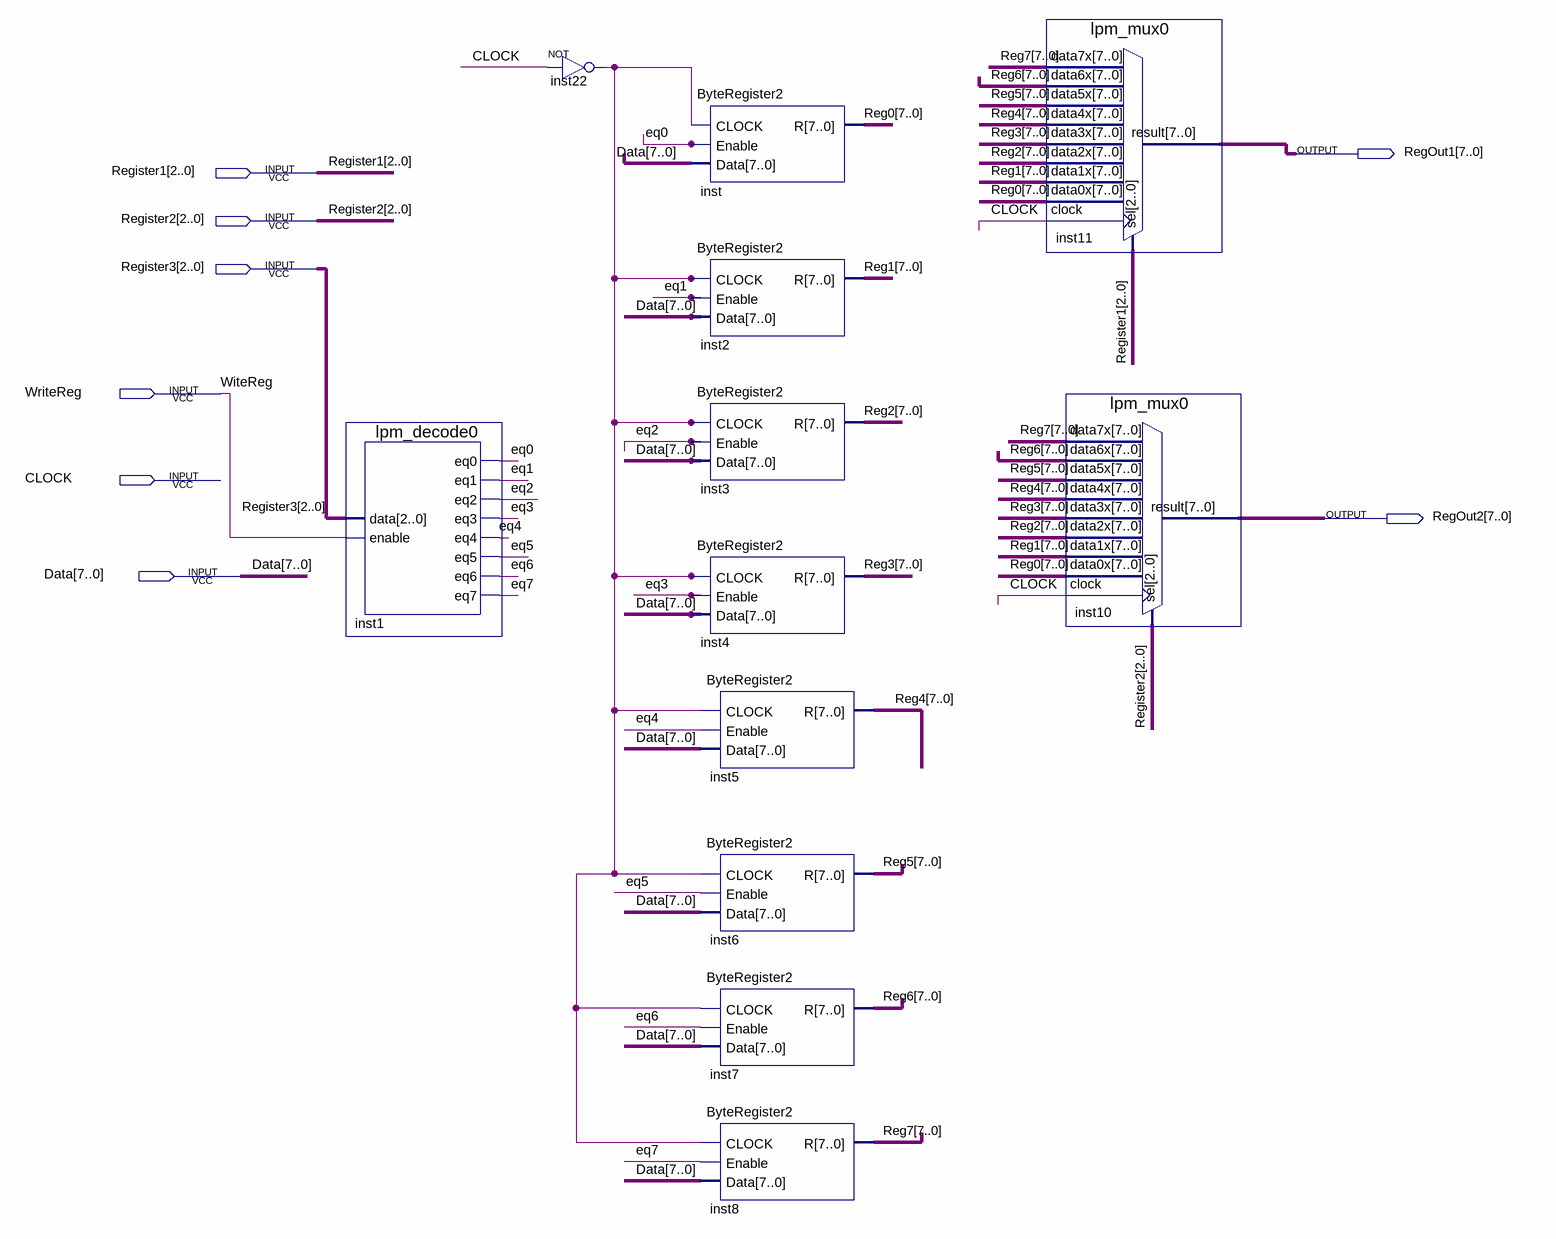
[diagram p0: schematic sheet]
// Quartus schematic registerFile2.bdf as structural Verilog: 12 symbols, 8 pins
module registerFile2 (
  input  [2:0] Register1,
  input  [2:0] Register2,
  input  [2:0] Register3,
  input  WriteReg,
  input  CLOCK,
  input  [7:0] Data,
  output [7:0] RegOut1,
  output [7:0] RegOut2
);

  wire eq0, eq1, eq2, eq3, eq4, eq5, eq6, eq7, inst22_out;
  wire [7:0] Reg0, Reg1, Reg2, Reg3, Reg4, Reg5, Reg6, Reg7;

  lpm_decode0 inst1 (
    .data(Register3), .enable(WriteReg), .eq0(eq0), .eq1(eq1), .eq2(eq2), .eq3(eq3), .eq4(eq4), .eq5(eq5),
    .eq6(eq6), .eq7(eq7));
  not inst22 (inst22_out, CLOCK);
  ByteRegister2 inst (.CLOCK(inst22_out), .Enable(eq0), .Data(Data), .R(Reg0));
  ByteRegister2 inst2 (.CLOCK(inst22_out), .Enable(eq1), .Data(Data), .R(Reg1));
  ByteRegister2 inst3 (.CLOCK(inst22_out), .Enable(eq2), .Data(Data), .R(Reg2));
  ByteRegister2 inst4 (.CLOCK(inst22_out), .Enable(eq3), .Data(Data), .R(Reg3));
  ByteRegister2 inst5 (.CLOCK(inst22_out), .Enable(eq4), .Data(Data), .R(Reg4));
  ByteRegister2 inst6 (.CLOCK(inst22_out), .Enable(eq5), .Data(Data), .R(Reg5));
  ByteRegister2 inst7 (.CLOCK(inst22_out), .Enable(eq6), .Data(Data), .R(Reg6));
  ByteRegister2 inst8 (.CLOCK(inst22_out), .Enable(eq7), .Data(Data), .R(Reg7));
  lpm_mux0 inst11 (
    .data7x(Reg7), .data6x(Reg6), .data5x(Reg5), .data4x(Reg4), .data3x(Reg3), .data2x(Reg2), .data1x(Reg1),
    .data0x(Reg0), .clock(CLOCK), .sel(Register1), .result(RegOut1));
  lpm_mux0 inst10 (
    .data7x(Reg7), .data6x(Reg6), .data5x(Reg5), .data4x(Reg4), .data3x(Reg3), .data2x(Reg2), .data1x(Reg1),
    .data0x(Reg0), .clock(CLOCK), .sel(Register2), .result(RegOut2));

  // Other names for the same wires on the sheet: WiteReg = WriteReg
endmodule
